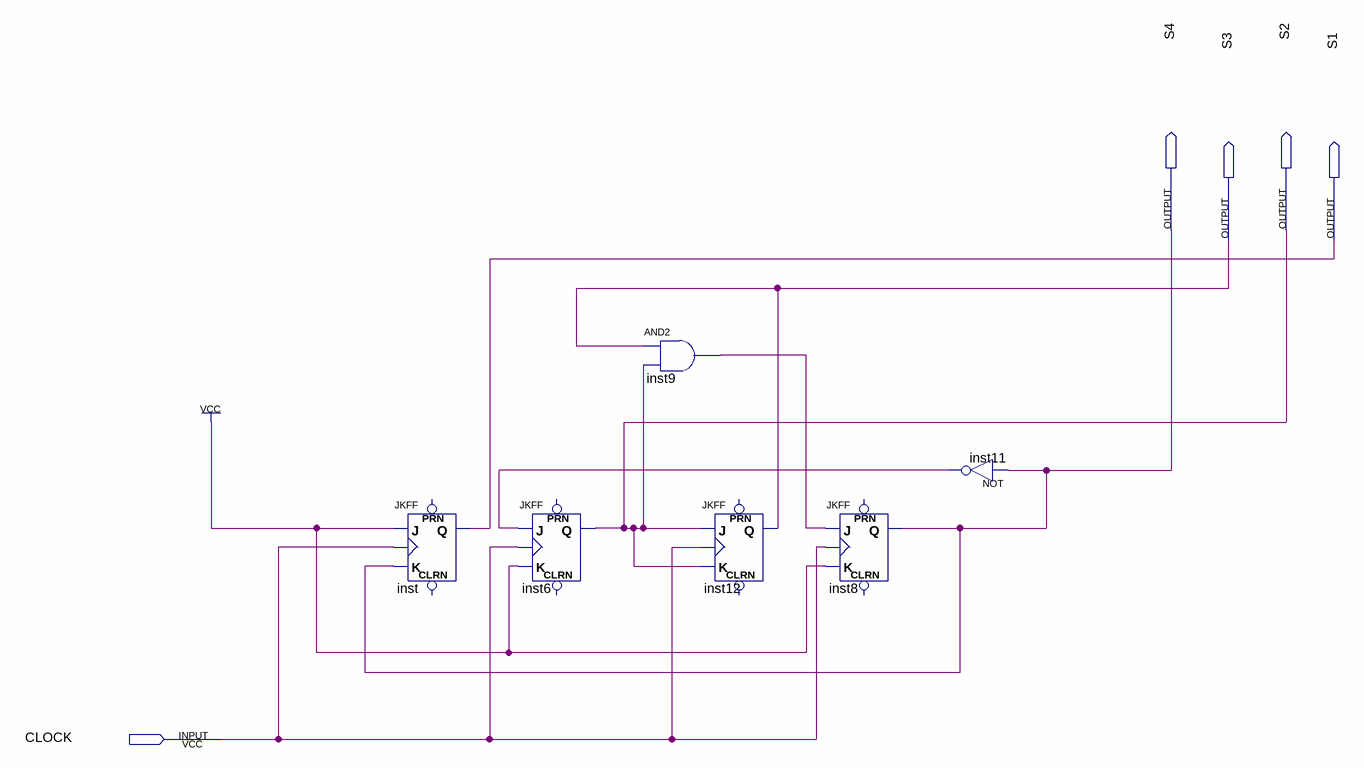
[diagram p0: schematic sheet]
// Quartus schematic circuit.bdf as structural Verilog: 6 symbols, 5 pins
module circuit (
  input  CLOCK,
  output S4,
  output S2,
  output S3,
  output S1
);

  wire inst9_out, inst11_out;

  JKFF inst (.K(S4), .J(1'b1), .CLK(CLOCK), .Q(S1));  // open: PRN, CLRN
  JKFF inst6 (.K(1'b1), .J(inst11_out), .CLK(CLOCK), .Q(S2));  // open: PRN, CLRN
  and inst9 (inst9_out, S3, S2);
  JKFF inst12 (.K(S2), .J(S2), .CLK(CLOCK), .Q(S3));  // open: PRN, CLRN
  JKFF inst8 (.K(1'b1), .J(inst9_out), .CLK(CLOCK), .Q(S4));  // open: PRN, CLRN
  not inst11 (inst11_out, S4);
endmodule
